# EAGLE design amp_summator_v_1_0 (EAGLE 6.4)
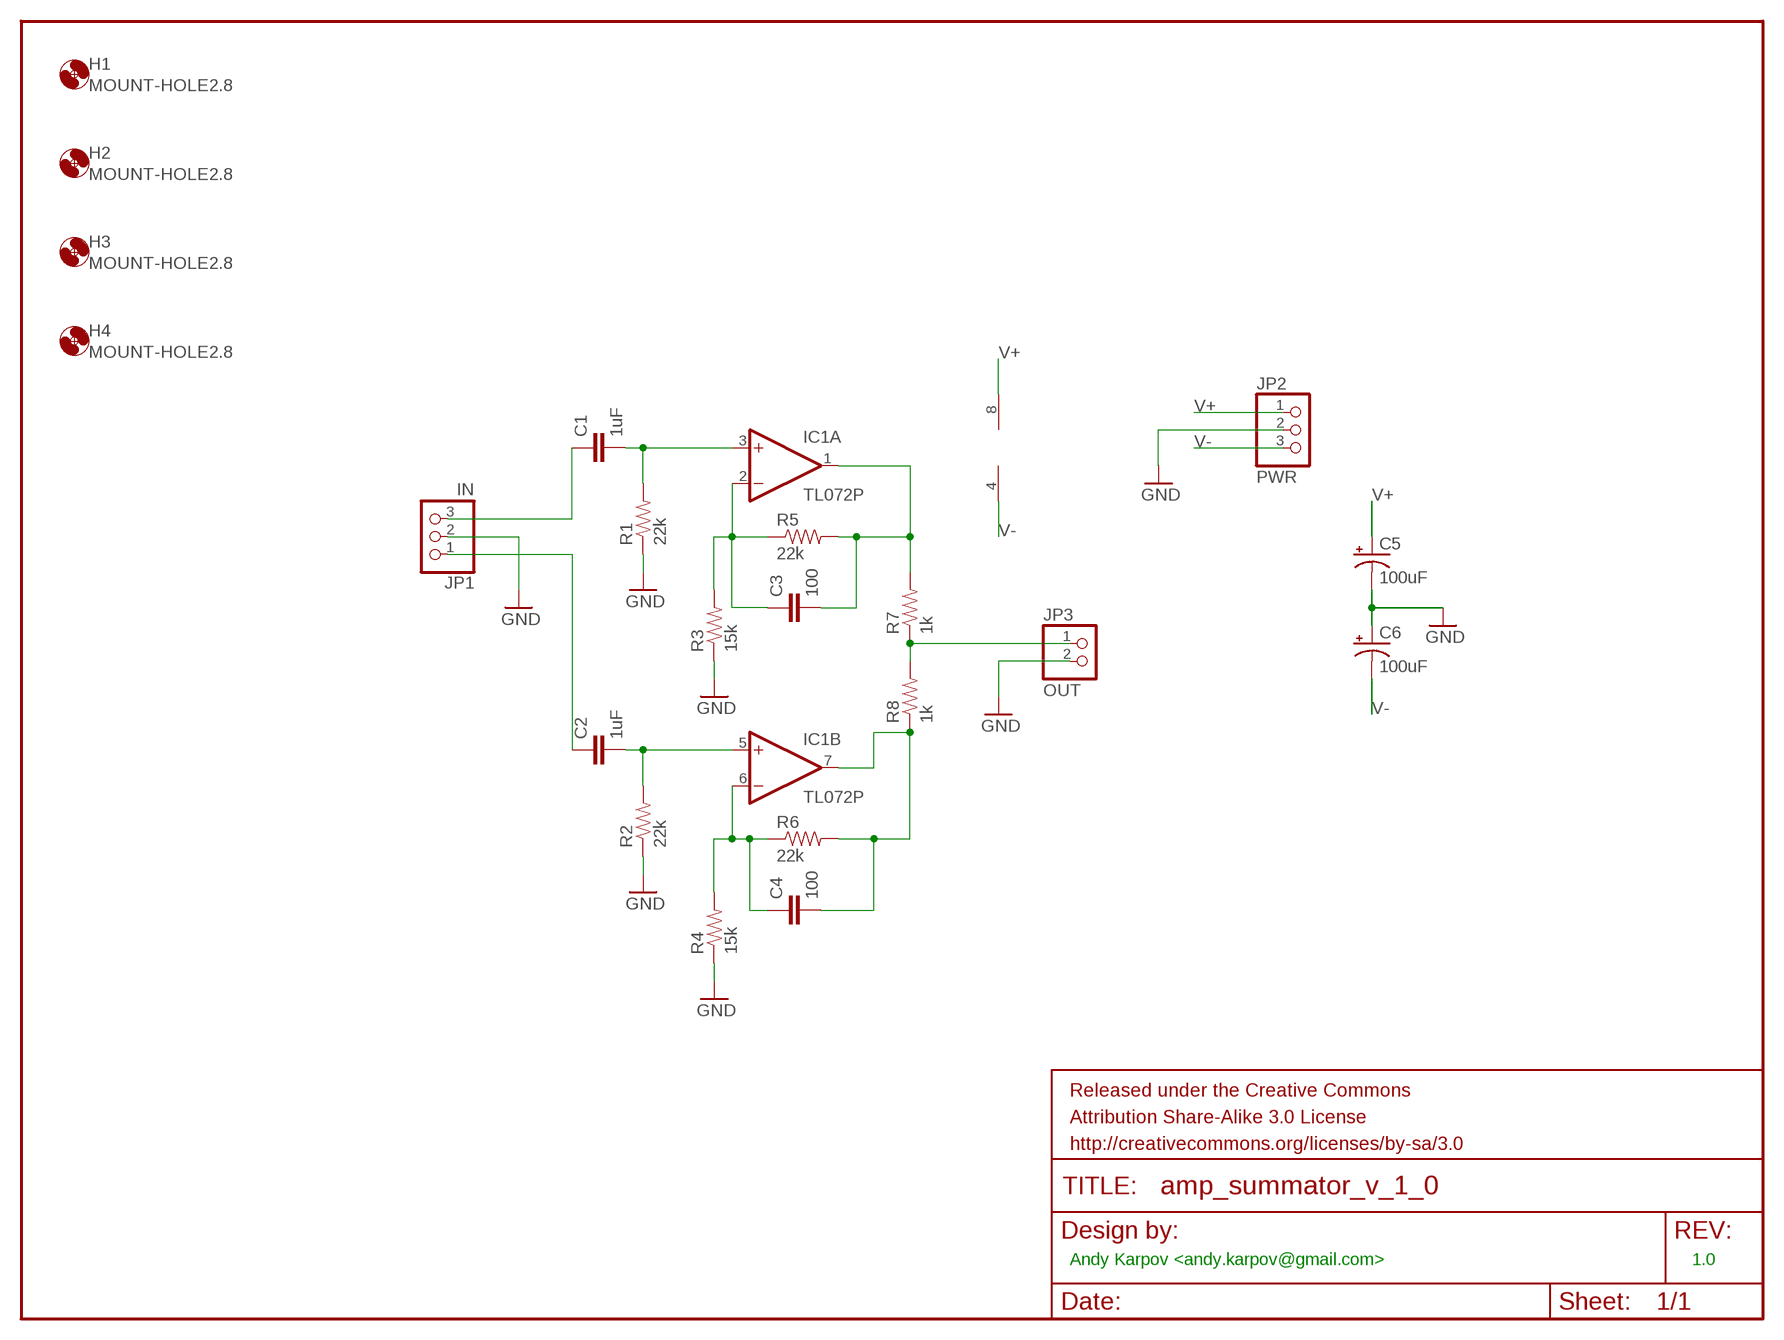
[diagram p0: schematic, sheet 1]

## Parts
C1  1uF  CAPPTH1  [CAP-PTH-5MM]
C2  1uF  CAPPTH1  [CAP-PTH-5MM]
C3  100  CAPPTH1  [CAP-PTH-5MM]
C4  100  CAPPTH1  [CAP-PTH-5MM]
C5  100uF  CAP_POLPTH1  [CPOL-RADIAL-100UF-25V]
C6  100uF  CAP_POLPTH1  [CPOL-RADIAL-100UF-25V]
FRAME1  FRAME-LETTER  [CREATIVE_COMMONS]
H1  MOUNT-HOLE2.8  [2,8]
H2  MOUNT-HOLE2.8  [2,8]
H3  MOUNT-HOLE2.8  [2,8]
H4  MOUNT-HOLE2.8  [2,8]
IC1  TL072P  [DIL08]
JP1  IN  PINHD-1X3  [1X03]
JP2  PWR  PINHD-1X3  [1X03]
JP3  OUT  PINHD-1X2  [1X02]
R1  22k  RESISTORPTH-1/4W  [AXIAL-0.4]
R2  22k  RESISTORPTH-1/4W  [AXIAL-0.4]
R3  15k  RESISTORPTH-1/4W  [AXIAL-0.4]
R4  15k  RESISTORPTH-1/4W  [AXIAL-0.4]
R5  22k  RESISTORPTH-1/4W  [AXIAL-0.4]
R6  22k  RESISTORPTH-1/4W  [AXIAL-0.4]
R7  1k  RESISTORPTH-1/4W  [AXIAL-0.4]
R8  1k  RESISTORPTH-1/4W  [AXIAL-0.4]

## Nets
GND: C5.2(-) C6.1(+) JP1.2 JP2.2 JP3.2 R1.P$1 R2.P$1 R3.P$1 R4.P$1
N$1: C1.1 JP1.3
N$2: JP3.1 R7.P$1 R8.P$2
N$3: C3.2 IC1.1(A:OUT) R5.P$2 R7.P$2
N$5: C4.2 IC1.7(B:OUT) R6.P$2 R8.P$1
N$6: C3.1 IC1.2(A:-IN) R3.P$2 R5.P$1
N$8: C1.2 IC1.3(A:+IN) R1.P$2
N$10: C2.1 JP1.1
N$11: C2.2 IC1.5(B:+IN) R2.P$2
N$12: C4.1 IC1.6(B:-IN) R4.P$2 R6.P$1
V+: C5.1(+) IC1.8(P:V+) JP2.1
V-: C6.2(-) IC1.4(P:V-) JP2.3

## Notes on the sheet
- Andy Karpov <andy.karpov@gmail.com> | 1.0

## Library data of the parts
C1-C4 = SparkFun-Capacitors:CAP: Capacitor Standard 0603 ceramic capacitor, and 0.1" leaded capacitor.
C5 C6 = SparkFun-Capacitors:CAP_POL: Capacitor Polarized These are standard SMD and PTH capacitors. Normally 10uF, 47uF, and 100uF in electrolytic and tantalum varieties. Always verify the external diameter of the through hole cap, it varies with capacity, voltage, and manufacturer. The EIA devices should be standard.
FRAME1 = SparkFun-Aesthetics:FRAME-LETTER: Schematic Frame Standard 8.5x11 US Letter frame
H1-H4 = holes:MOUNT-HOLE: MOUNTING HOLE with drill center marker
IC1 = linear:TL072: OP AMP
JP1 JP2 = pinhead:PINHD-1X3: PIN HEADER
JP3 = pinhead:PINHD-1X2: PIN HEADER
R1-R8 = SparkFun-Resistors:RESISTOR: Resistor Basic schematic elements and footprints for 0603, 1206, and PTH resistors.

## Board
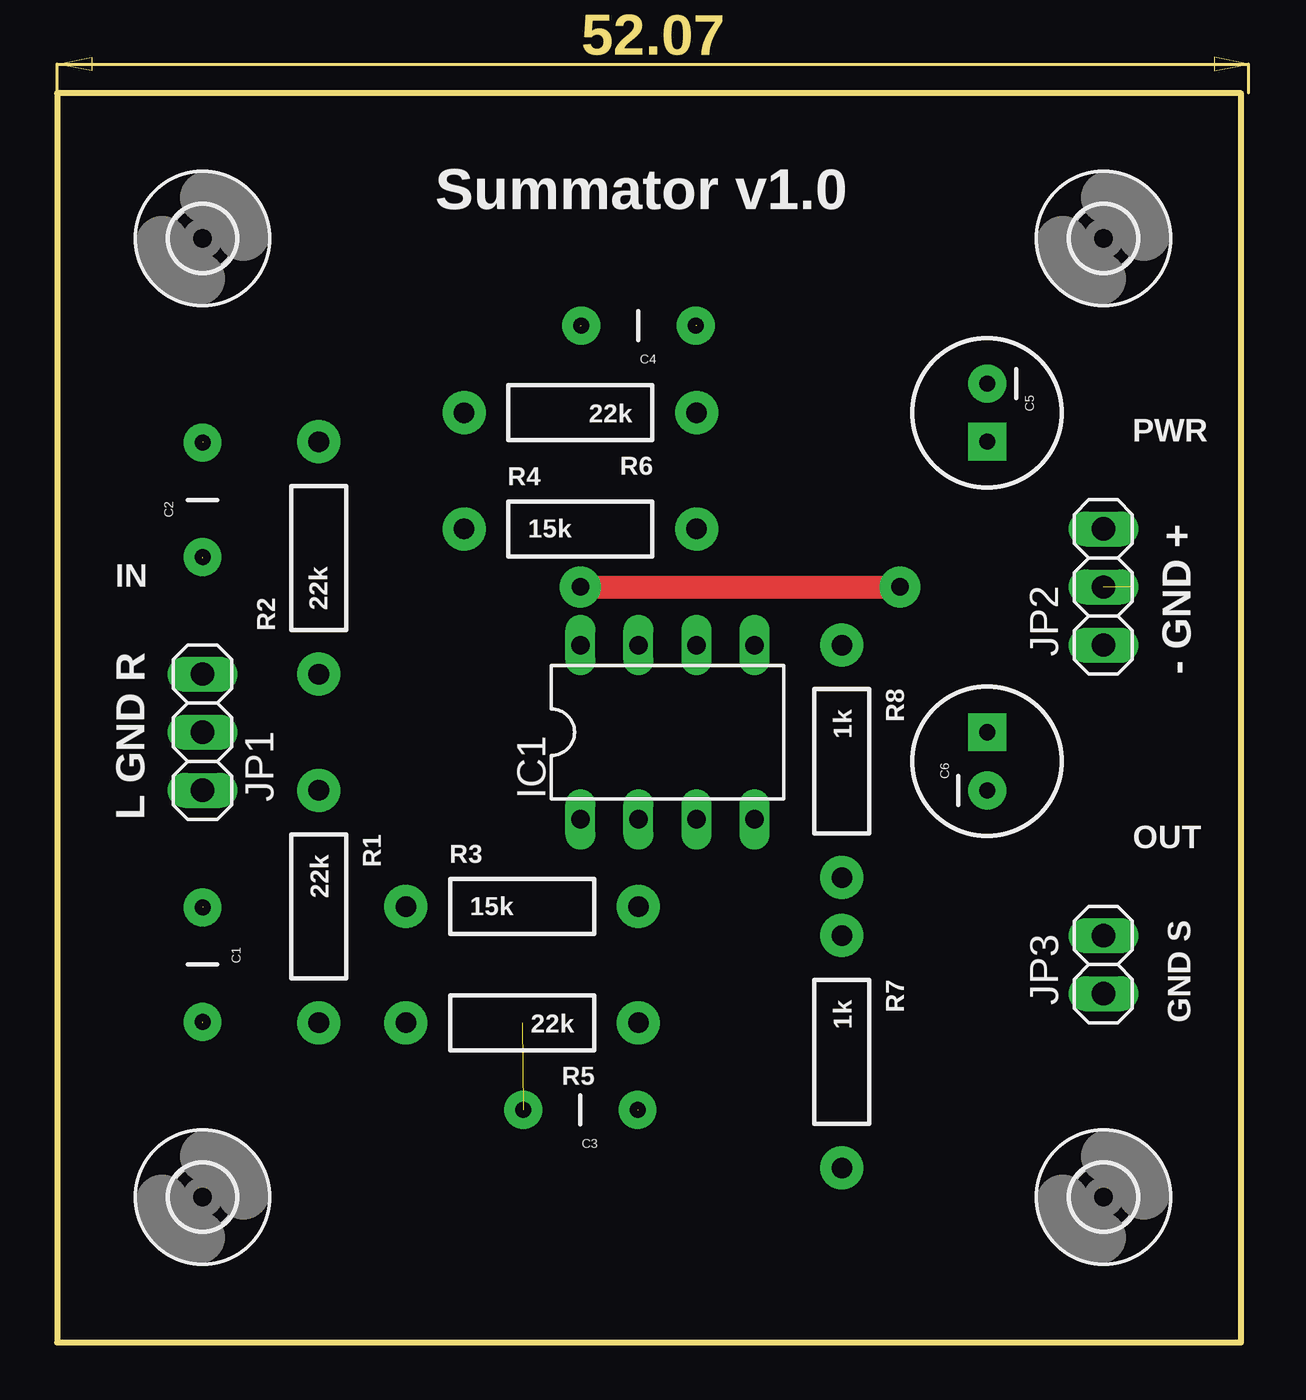
[diagram p1: board, top side]
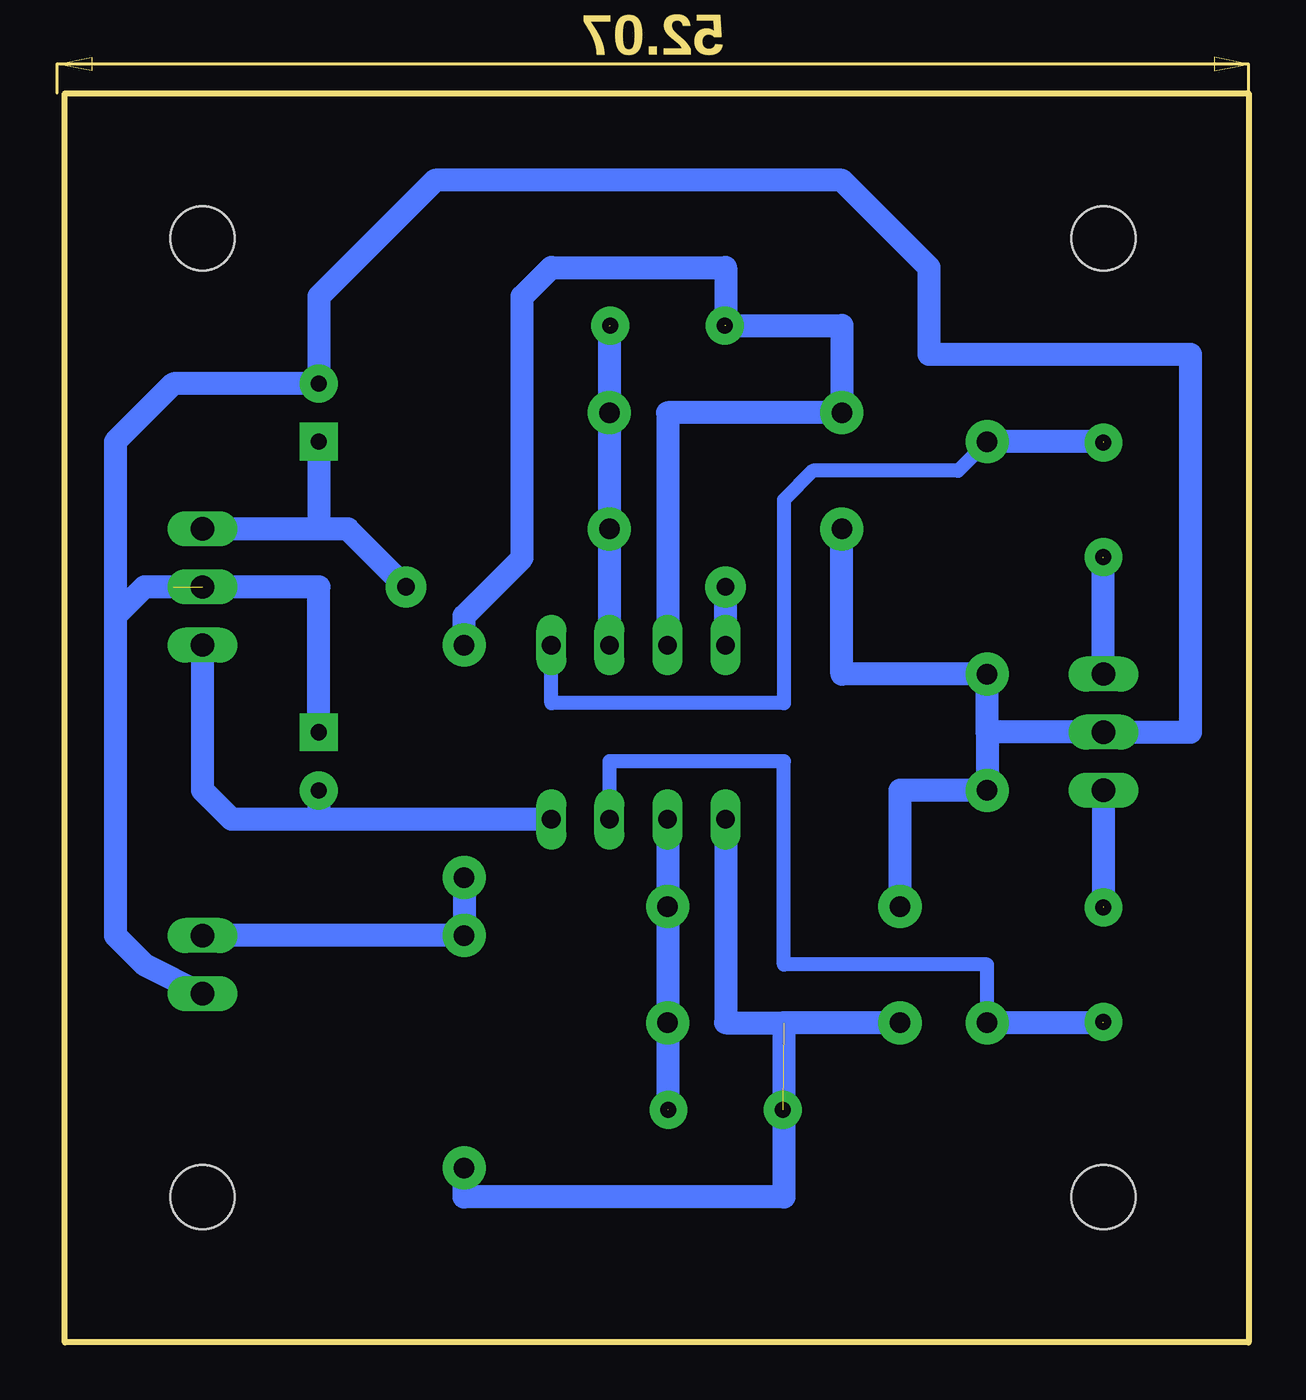
[diagram p2: board, bottom side, seen from below]

Size 51.74 x 54.6 mm. Coordinates in mm from the lower left corner, seen from the top.
Outline: 0,0 51.74,0 51.74,54.6 0,54.6 0,0
Copper layers (1*16): Top 0.035mm / dielectric 1.5mm / Bottom 0.035mm
Design rules "default": minimum track width 10mil, minimum drill 24mil, track to track 8mil, track to pad 8mil, pad to pad 8mil, via to via 8mil, smd to smd 8mil, copper to edge 40mil, drill to drill 8mil, minimum pad ring 10mil, minimum via ring 8mil, stop-mask expansion 4mil, vias tented up to drill 0mil, thermal gap 10mil

### Footprints (pad centres in the part's own frame; a part is rotated, then mirrored left to right if it is on the bottom)
CAP-PTH-5MM = drill 0.7 pad 1.651: 1 -2.5,0; 2 2.5,0
CPOL-RADIAL-100UF-25V = drill 0.7 pad 1.651 square: 1 1.27,0 | drill 0.7 pad 1.651: 2 -1.27,0
2,8 = hole 2.8: 0,0
DIL08 = drill 0.813 pad 1.27 long: 1 -3.81,-3.81; 2 -1.27,-3.81; 3 1.27,-3.81; 4 3.81,-3.81; 5 3.81,3.81; 6 1.27,3.81; 7 -1.27,3.81; 8 -3.81,3.81
1X03 = drill 1.016 long: 1 -2.54,0; 2 0,0; 3 2.54,0
1X02 = drill 1.016 long: 1 -1.27,0; 2 1.27,0
AXIAL-0.4 = drill 0.9 pad 1.88: P$1 -5.08,0; P$2 5.08,0

### Placement (x,y rotation side)
C1  6.35,16.51 270 top
C2  6.35,36.83 90 top
C3  22.86,10.16 180 top
C4  25.4,44.45 180 top
C5  40.64,40.64 270 top
C6  40.64,25.4 90 top
FRAME1  0,54.61 0 top
H1  45.72,48.26 0 top
H2  6.35,48.26 0 top
H3  45.72,6.35 0 top
H4  6.35,6.35 0 top
IC1  26.67,26.67 0 top
JP1  6.35,26.67 270 top
JP2  45.72,33.02 270 top
JP3  45.72,16.51 270 top
R1  11.43,19.05 270 top
R2  11.43,34.29 90 top
R3  20.32,19.05 0 top
R4  22.86,35.56 0 top
R5  20.32,13.97 180 top
R6  22.86,40.64 180 top
R7  34.29,12.7 270 top
R8  34.29,25.4 270 top

### Tracks (layer width: path | path; a pad name or v marks a point on that pad's centre or on a via)
GND  (1 unrouted)
  Bottom 1.016: 11.43,26.67 JP1.2 2.54,26.67 2.54,43.18 13.97,43.18 13.97,46.99 17.78,50.8 35.56,50.8 40.64,45.72 C5.2 46.99,41.91 49.53,39.37 49.53,31.75 | 11.43,26.67 R2.P$1 17.78,29.21 R4.P$1 | 11.43,26.67 R1.P$1 15.24,24.13 R3.P$1 | C6.1 40.64,33.02 JP2.2 | 46.99,33.02 48.26,33.02 49.53,31.75 | 49.53,31.75 49.53,17.78 48.26,16.51 JP3.2
N$1  (1 unrouted)
  Bottom 1.016: JP1.3 6.35,19.05
N$2
  Bottom 1.016: JP3.1 R7.P$1 R8.P$2
N$3  (1 unrouted)
  Bottom 1.016: R5.P$2 20.32,13.97 | 20.32,13.97 20.32,6.35 34.29,6.35 R7.P$2 | IC1.1 22.86,13.97 20.32,13.97
N$5  (1 unrouted)
  Bottom 1.016: R8.P$1 34.29,31.75 31.75,34.29 31.75,45.72 30.48,46.99 22.86,46.99 22.86,44.45 17.78,44.45 R6.P$2 25.4,40.64 IC1.7
N$6  (1 unrouted)
  Bottom 1.016: IC1.2 R3.P$2 R5.P$1 25.4,10.16
N$8  (1 unrouted)
  Bottom 0.61: R1.P$2 11.43,16.51 20.32,16.51 20.32,25.4 27.94,25.4 IC1.3
  Bottom 1.016: 6.35,13.97 R1.P$2
N$10  (1 unrouted)
  Bottom 1.016: JP1.1 6.35,34.29
N$11  (1 unrouted)
  Bottom 0.61: R2.P$2 12.7,38.1 19.05,38.1 20.32,36.83 20.32,27.94 30.48,27.94 IC1.5
  Bottom 1.016: 6.35,39.37 R2.P$2
N$12  (1 unrouted)
  Bottom 1.016: 27.94,44.45 R6.P$1 R4.P$2 IC1.6
V+  (via drill 0.76 pad 1.78)
  Top 1.016: v22.86,33.02 v36.83,33.02
  Bottom 1.016: IC1.8 v22.86,33.02 | v36.83,33.02 39.37,35.56 40.64,35.56 | 40.64,35.56 JP2.1 | C5.1 40.64,35.56
V-
  Bottom 1.016: IC1.4 40.64,22.86 | 40.64,22.86 44.45,22.86 45.72,24.13 JP2.3 | C6.2 40.64,22.86

### Text on the board
tPlace: Summator v1.0 | PWR | IN | - GND + | L GND R | OUT | GND S